# EAGLE schematic Precision Arduino 7400 (EAGLE 6.2)
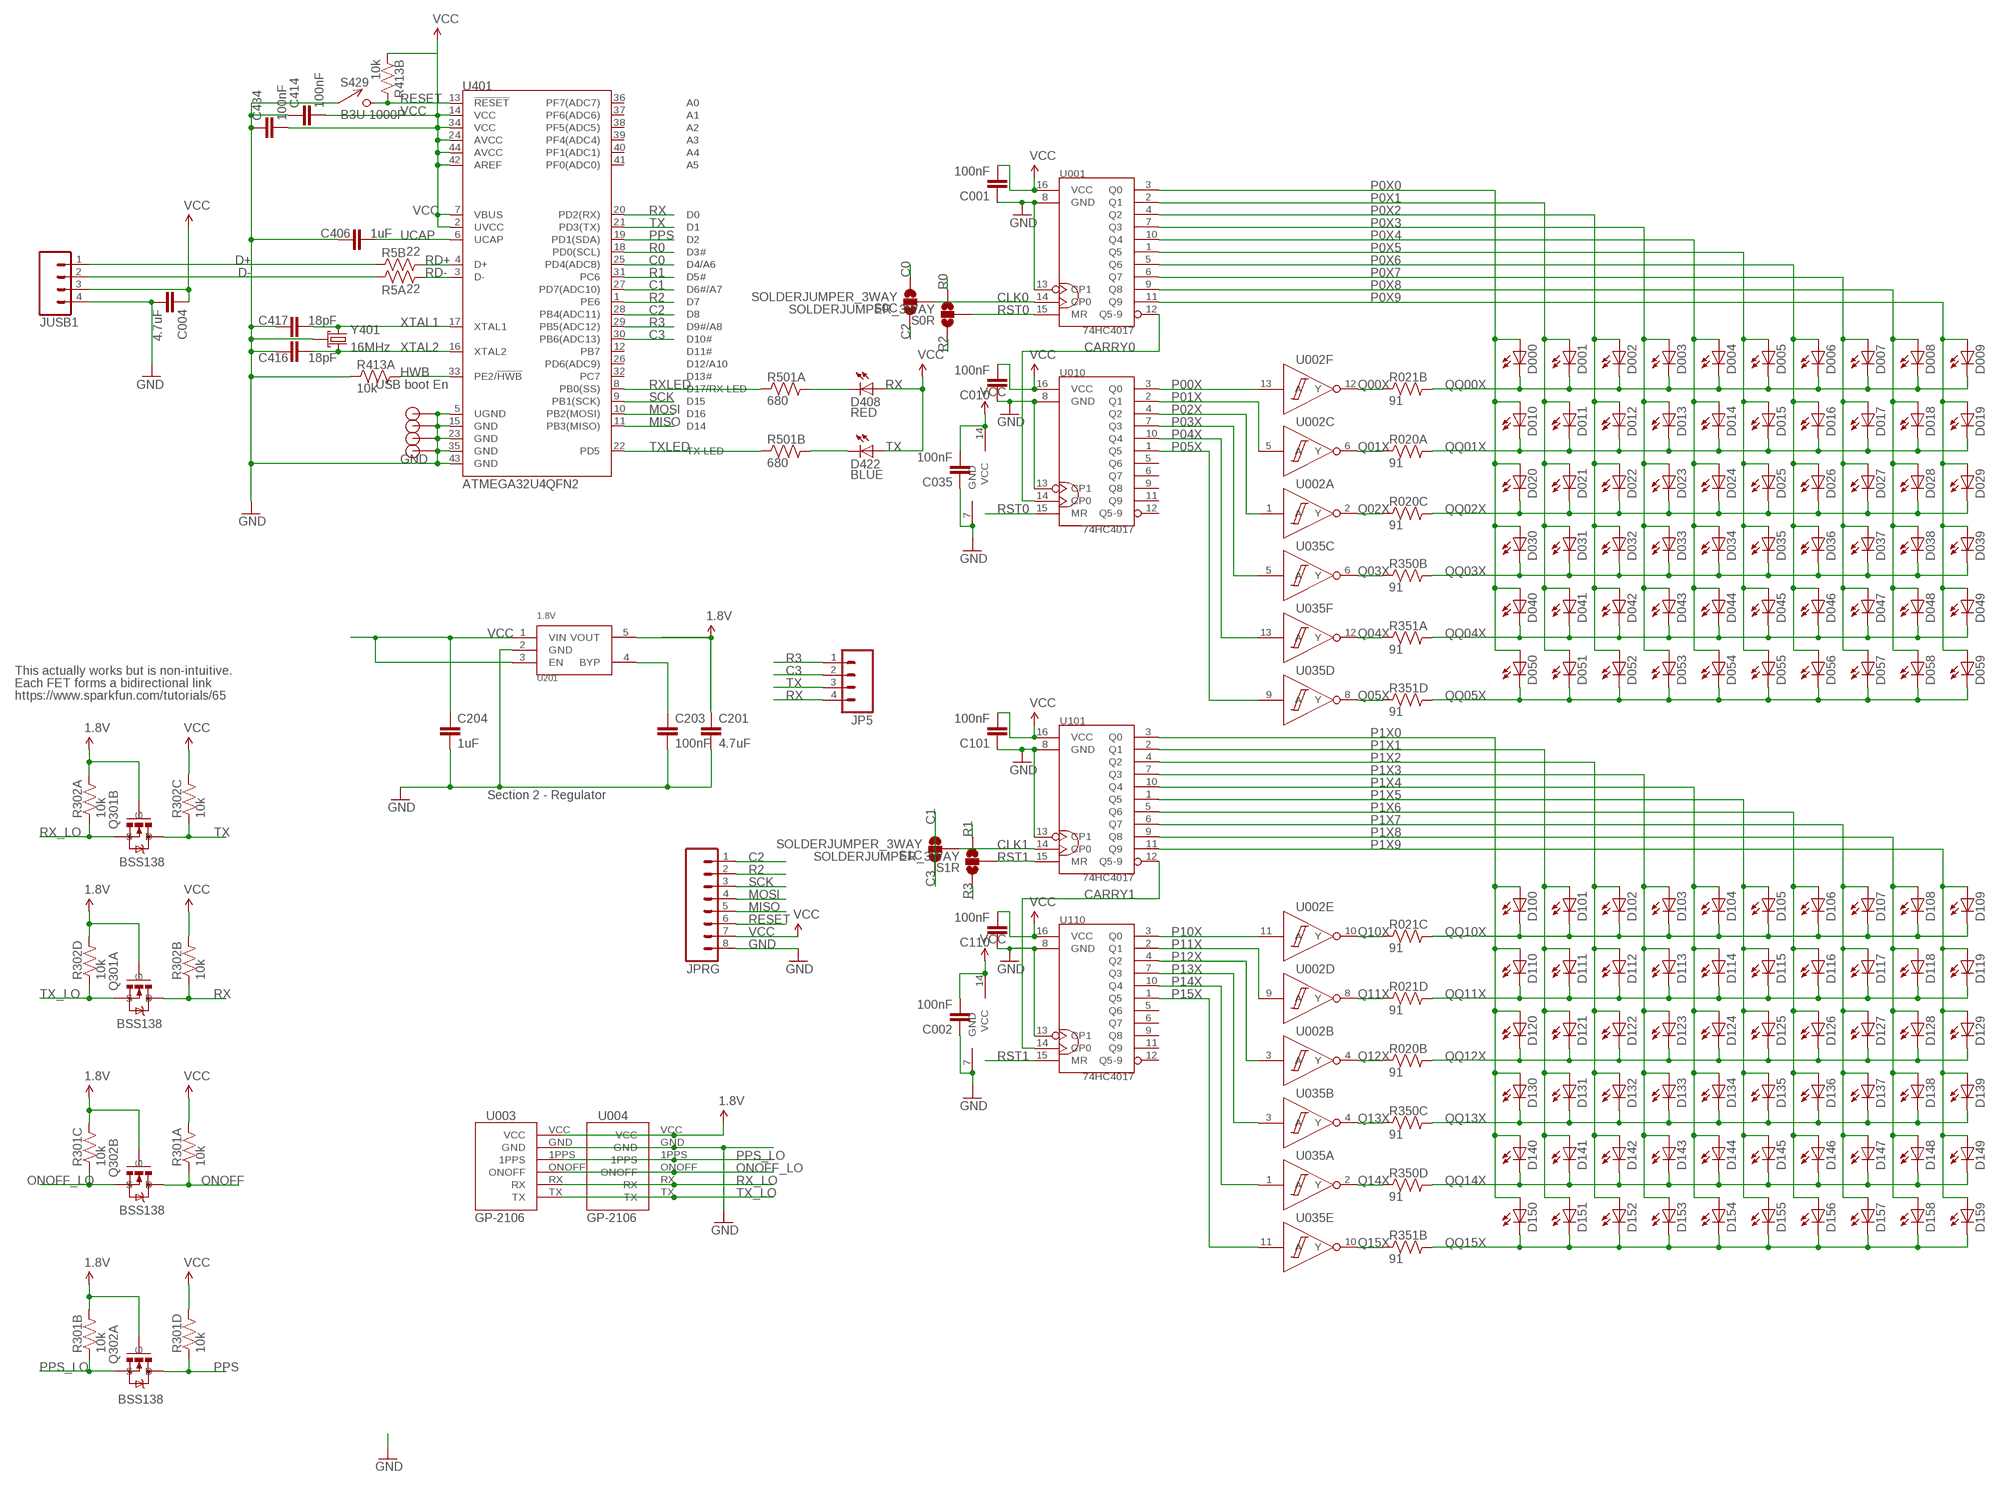
[diagram p0: schematic, sheet 1]

## Parts
C001  100nF  CAP0603-CAP  [0603-CAP]
C002  100nF  CAP0603-CAP  [0603-CAP]
C004  4.7uF  CAP0603-CAP  [0603-CAP]
C010  100nF  CAP0603-CAP  [0603-CAP]
C035  100nF  CAP0603-CAP  [0603-CAP]
C101  100nF  CAP0603-CAP  [0603-CAP]
C110  100nF  CAP0603-CAP  [0603-CAP]
C201  4.7uF  CAP0603-CAP  [0603-CAP]
C203  100nF  CAP0603-CAP  [0603-CAP]
C204  1uF  CAP0603-CAP  [0603-CAP]
C406  1uF  CAP0603-CAP  [0603-CAP]
C414  100nF  CAP0603-CAP  [0603-CAP]
C416  18pF  CAP0603-CAP  [0603-CAP]
C417  18pF  CAP0603-CAP  [0603-CAP]
C434  100nF  CAP0603-CAP  [0603-CAP]
D000  RED  LED0603  [LED-0603]
D001  RED  LED0603  [LED-0603]
D002  RED  LED0603  [LED-0603]
D003  RED  LED0603  [LED-0603]
D004  RED  LED0603  [LED-0603]
D005  RED  LED0603  [LED-0603]
D006  RED  LED0603  [LED-0603]
D007  RED  LED0603  [LED-0603]
D008  RED  LED0603  [LED-0603]
D009  RED  LED0603  [LED-0603]
D010  RED  LED0603  [LED-0603]
D011  RED  LED0603  [LED-0603]
D012  RED  LED0603  [LED-0603]
D013  RED  LED0603  [LED-0603]
D014  RED  LED0603  [LED-0603]
D015  RED  LED0603  [LED-0603]
D016  RED  LED0603  [LED-0603]
D017  RED  LED0603  [LED-0603]
D018  RED  LED0603  [LED-0603]
D019  RED  LED0603  [LED-0603]
D020  RED  LED0603  [LED-0603]
D021  RED  LED0603  [LED-0603]
D022  RED  LED0603  [LED-0603]
D023  RED  LED0603  [LED-0603]
D024  RED  LED0603  [LED-0603]
D025  RED  LED0603  [LED-0603]
D026  RED  LED0603  [LED-0603]
D027  RED  LED0603  [LED-0603]
D028  RED  LED0603  [LED-0603]
D029  RED  LED0603  [LED-0603]
D030  RED  LED0603  [LED-0603]
D031  RED  LED0603  [LED-0603]
D032  RED  LED0603  [LED-0603]
D033  RED  LED0603  [LED-0603]
D034  RED  LED0603  [LED-0603]
D035  RED  LED0603  [LED-0603]
D036  RED  LED0603  [LED-0603]
D037  RED  LED0603  [LED-0603]
D038  RED  LED0603  [LED-0603]
D039  RED  LED0603  [LED-0603]
D040  RED  LED0603  [LED-0603]
D041  RED  LED0603  [LED-0603]
D042  RED  LED0603  [LED-0603]
D043  RED  LED0603  [LED-0603]
D044  RED  LED0603  [LED-0603]
D045  RED  LED0603  [LED-0603]
D046  RED  LED0603  [LED-0603]
D047  RED  LED0603  [LED-0603]
D048  RED  LED0603  [LED-0603]
D049  RED  LED0603  [LED-0603]
D050  RED  LED0603  [LED-0603]
D051  RED  LED0603  [LED-0603]
D052  RED  LED0603  [LED-0603]
D053  RED  LED0603  [LED-0603]
D054  RED  LED0603  [LED-0603]
D055  RED  LED0603  [LED-0603]
D056  RED  LED0603  [LED-0603]
D057  RED  LED0603  [LED-0603]
D058  RED  LED0603  [LED-0603]
D059  RED  LED0603  [LED-0603]
D100  RED  LED0603  [LED-0603]
D101  RED  LED0603  [LED-0603]
D102  RED  LED0603  [LED-0603]
D103  RED  LED0603  [LED-0603]
D104  RED  LED0603  [LED-0603]
D105  RED  LED0603  [LED-0603]
D106  RED  LED0603  [LED-0603]
D107  RED  LED0603  [LED-0603]
D108  RED  LED0603  [LED-0603]
D109  RED  LED0603  [LED-0603]
D110  RED  LED0603  [LED-0603]
D111  RED  LED0603  [LED-0603]
D112  RED  LED0603  [LED-0603]
D113  RED  LED0603  [LED-0603]
D114  RED  LED0603  [LED-0603]
D115  RED  LED0603  [LED-0603]
D116  RED  LED0603  [LED-0603]
D117  RED  LED0603  [LED-0603]
D118  RED  LED0603  [LED-0603]
D119  RED  LED0603  [LED-0603]
D120  RED  LED0603  [LED-0603]
D121  RED  LED0603  [LED-0603]
D122  RED  LED0603  [LED-0603]
D123  RED  LED0603  [LED-0603]
D124  RED  LED0603  [LED-0603]
D125  RED  LED0603  [LED-0603]
D126  RED  LED0603  [LED-0603]
D127  RED  LED0603  [LED-0603]
D128  RED  LED0603  [LED-0603]
D129  RED  LED0603  [LED-0603]
D130  RED  LED0603  [LED-0603]
D131  RED  LED0603  [LED-0603]
D132  RED  LED0603  [LED-0603]
D133  RED  LED0603  [LED-0603]
D134  RED  LED0603  [LED-0603]
D135  RED  LED0603  [LED-0603]
D136  RED  LED0603  [LED-0603]
D137  RED  LED0603  [LED-0603]
D138  RED  LED0603  [LED-0603]
D139  RED  LED0603  [LED-0603]
D140  RED  LED0603  [LED-0603]
D141  RED  LED0603  [LED-0603]
D142  RED  LED0603  [LED-0603]
D143  RED  LED0603  [LED-0603]
D144  RED  LED0603  [LED-0603]
D145  RED  LED0603  [LED-0603]
D146  RED  LED0603  [LED-0603]
D147  RED  LED0603  [LED-0603]
D148  RED  LED0603  [LED-0603]
D149  RED  LED0603  [LED-0603]
D150  RED  LED0603  [LED-0603]
D151  RED  LED0603  [LED-0603]
D152  RED  LED0603  [LED-0603]
D153  RED  LED0603  [LED-0603]
D154  RED  LED0603  [LED-0603]
D155  RED  LED0603  [LED-0603]
D156  RED  LED0603  [LED-0603]
D157  RED  LED0603  [LED-0603]
D158  RED  LED0603  [LED-0603]
D159  RED  LED0603  [LED-0603]
D408  RED  LED0603  [LED-0603]
D422  BLUE  LED0603  [LED-0603]
JP1  STANDOFF  [STANDOFF]
JP2  STANDOFF  [STANDOFF]
JP3  STANDOFF  [STANDOFF]
JP4  STANDOFF  [STANDOFF]
JP5  M04PTH  [1X04]
JPRG  M081X08  [1X08]
JUSB1  M04PTH  [1X04]
Q301  BSS138DW  [SOT-363]
Q302  BSS138DW  [SOT-363]
R5  22  RP2EXB24V  [CRA02]
R020  91  RP404  [CRA04]
R021  91  RP404  [CRA04]
R301  10k  RP404  [CRA04]
R302  10k  RP404  [CRA04]
R350  91  RP404  [CRA04]
R351  91  RP404  [CRA04]
R413  10k  RP2EXB24V  [CRA02]
R501  680  RP2EXB24V  [CRA02]
S0C  SOLDERJUMPER_3WAY  [SJ_3]
S0R  SOLDERJUMPER_3WAY  [SJ_3]
S1C  SOLDERJUMPER_3WAY  [SJ_3]
S1R  SOLDERJUMPER_3WAY  [SJ_3]
S429  B3U-1000P  [B3U-1000P]
U001  74HC4017  [DHVQFN16]
U002  74LVC14A  [DHVQFN14]
U003  GP-2106  [GP-2106]
U004  GP-2106  [GP-2106]
U010  74HC4017  [DHVQFN16]
U035  74LVC14A  [DHVQFN14]
U101  74HC4017  [DHVQFN16]
U110  74HC4017  [DHVQFN16]
U201  1.8V  MIC5319D5  [SOT-23-5]
U401  ATMEGA32U4QFN2  [SPARKFUN-DIGITALIC_QFN-44-NOPAD]
Y401  16MHz  TSX-3225  [CRYSTAL_SMD]

## Nets
1.8V: C201.1 Q301.2(A:G) Q301.5(B:G) Q302.2(A:G) Q302.5(B:G) R301.6 R301.7 R302.5 R302.8 U003.VCC U004.VCC U201.5(VOUT)
C0: S0C.3 U401.25(PD4(ADC8))
C1: S1C.1 U401.27(PD7(ADC10))
C2: JPRG.1 S0C.1 U401.28(PB4(ADC11))
C3: JP5.2 S1C.3 U401.30(PB6(ADC13))
CARRY0: U001.12(Q5-9) U010.14(CP0)
CARRY1: U101.12(Q5-9) U110.14(CP0)
CLK0: S0C.COM U001.14(CP0)
CLK1: S1C.COM U101.14(CP0)
D+: JUSB1.1 R5.2
D-: JUSB1.2 R5.1
GND: C001.1 C002.1 C004.2 C010.1 C035.1 C101.1 C110.1 C201.2 C203.2 C204.2 C406.2 C414.1 C416.1 C417.1 C434.1 JP1.P$1 JP2.P$1 JP3.P$1 JP4.P$1 JPRG.8 JUSB1.4 R413.1 S429.P$1 U001.8(GND) U001.13(CP1) U002.7(GND) U003.GND U004.GND U010.8(GND) U010.13(CP1) U035.7(GND) U101.8(GND) U101.13(CP1) U110.8(GND) U110.13(CP1) U201.2(GND) U401.5(UGND) U401.15(GND) U401.23(GND) U401.35(GND) U401.43(GND) Y401.2(GND) Y401.4(GND)
HWB: R413.4 U401.33(PE2/!HWB)
MISO: JPRG.5 U401.11(PB3(MISO))
MOSI: JPRG.4 U401.10(PB2(MOSI))
N$17: C203.1 U201.4(BYP)
ONOFF: Q302.3(B:D) R301.1
ONOFF_LO: Q302.4(B:S) R301.3 U003.ONOFF U004.ONOFF
P00X: U002.13(F:A) U010.3(Q0)
P0X0: D000.A D010.A D020.A D030.A D040.A D050.A U001.3(Q0)
P0X1: D001.A D011.A D021.A D031.A D041.A D051.A U001.2(Q1)
P0X2: D002.A D012.A D022.A D032.A D042.A D052.A U001.4(Q2)
P0X3: D003.A D013.A D023.A D033.A D043.A D053.A U001.7(Q3)
P0X4: D004.A D014.A D024.A D034.A D044.A D054.A U001.10(Q4)
P0X5: D005.A D015.A D025.A D035.A D045.A D055.A U001.1(Q5)
P0X6: D006.A D016.A D026.A D036.A D046.A D056.A U001.5(Q6)
P0X7: D007.A D017.A D027.A D037.A D047.A D057.A U001.6(Q7)
P0X8: D008.A D018.A D028.A D038.A D048.A D058.A U001.9(Q8)
P0X9: D009.A D019.A D029.A D039.A D049.A D059.A U001.11(Q9)
P01X: U002.5(C:A) U010.2(Q1)
P1X0: D100.A D110.A D120.A D130.A D140.A D150.A U101.3(Q0)
P1X1: D101.A D111.A D121.A D131.A D141.A D151.A U101.2(Q1)
P1X2: D102.A D112.A D122.A D132.A D142.A D152.A U101.4(Q2)
P1X3: D103.A D113.A D123.A D133.A D143.A D153.A U101.7(Q3)
P1X4: D104.A D114.A D124.A D134.A D144.A D154.A U101.10(Q4)
P1X5: D105.A D115.A D125.A D135.A D145.A D155.A U101.1(Q5)
P1X6: D106.A D116.A D126.A D136.A D146.A D156.A U101.5(Q6)
P1X7: D107.A D117.A D127.A D137.A D147.A D157.A U101.6(Q7)
P1X8: D108.A D118.A D128.A D138.A D148.A D158.A U101.9(Q8)
P1X9: D109.A D119.A D129.A D139.A D149.A D159.A U101.11(Q9)
P02X: U002.1(A:A) U010.4(Q2)
P03X: U010.7(Q3) U035.5(C:A)
P04X: U010.10(Q4) U035.13(F:A)
P05X: U010.1(Q5) U035.9(D:A)
P10X: U002.11(E:A) U110.3(Q0)
P11X: U002.9(D:A) U110.2(Q1)
P12X: U002.3(B:A) U110.4(Q2)
P13X: U035.3(B:A) U110.7(Q3)
P14X: U035.1(A:A) U110.10(Q4)
P15X: U035.11(E:A) U110.1(Q5)
PPS: Q302.6(A:D) R301.4 U401.19(PD1(SDA))
PPS_LO: Q302.1(A:S) R301.2 U003.1PPS U004.1PPS
Q00X: R021.2 U002.12(F:Y)
Q01X: R020.1 U002.6(C:Y)
Q02X: R020.3 U002.2(A:Y)
Q03X: R350.2 U035.6(C:Y)
Q04X: R351.1 U035.12(F:Y)
Q05X: R351.4 U035.8(D:Y)
Q10X: R021.3 U002.10(E:Y)
Q11X: R021.4 U002.8(D:Y)
Q12X: R020.2 U002.4(B:Y)
Q13X: R350.3 U035.4(B:Y)
Q14X: R350.4 U035.2(A:Y)
Q15X: R351.2 U035.10(E:Y)
QQ00X: D000.C D001.C D002.C D003.C D004.C D005.C D006.C D007.C D008.C D009.C R021.7
QQ01X: D010.C D011.C D012.C D013.C D014.C D015.C D016.C D017.C D018.C D019.C R020.8
QQ02X: D020.C D021.C D022.C D023.C D024.C D025.C D026.C D027.C D028.C D029.C R020.6
QQ03X: D030.C D031.C D032.C D033.C D034.C D035.C D036.C D037.C D038.C D039.C R350.7
QQ04X: D040.C D041.C D042.C D043.C D044.C D045.C D046.C D047.C D048.C D049.C R351.8
QQ05X: D050.C D051.C D052.C D053.C D054.C D055.C D056.C D057.C D058.C D059.C R351.5
QQ10X: D100.C D101.C D102.C D103.C D104.C D105.C D106.C D107.C D108.C D109.C R021.6
QQ11X: D110.C D111.C D112.C D113.C D114.C D115.C D116.C D117.C D118.C D119.C R021.5
QQ12X: D120.C D121.C D122.C D123.C D124.C D125.C D126.C D127.C D128.C D129.C R020.7
QQ13X: D130.C D131.C D132.C D133.C D134.C D135.C D136.C D137.C D138.C D139.C R350.6
QQ14X: D140.C D141.C D142.C D143.C D144.C D145.C D146.C D147.C D148.C D149.C R350.5
QQ15X: D150.C D151.C D152.C D153.C D154.C D155.C D156.C D157.C D158.C D159.C R351.7
R0: S0R.3 U401.18(PD0(SCL))
R1: S1R.3 U401.31(PC6)
R2: JPRG.2 S0R.1 U401.1(PE6)
R3: JP5.1 S1R.1 U401.29(PB5(ADC12))
RD+: R5.3 U401.4(D+)
RD-: R5.4 U401.3(D-)
RESET: JPRG.6 R413.3 S429.P$2 U401.13(!RESET)
RST0: S0R.COM U001.15(MR) U010.15(MR)
RST1: S1R.COM U101.15(MR) U110.15(MR)
RX: JP5.4 Q301.6(A:D) R302.2 U401.20(PD2(RX))
RX_LO: Q301.4(B:S) R302.1 U003.RX U004.RX
RXLED: R501.1 U401.8(PB0(SS))
RXLED+: D408.C R501.4
SCK: JPRG.3 U401.9(PB1(SCK))
TX: JP5.3 Q301.3(B:D) R302.3 U401.21(PD3(TX))
TX_LO: Q301.1(A:S) R302.4 U003.TX U004.TX
TXLED: R501.2 U401.22(PD5)
TXLED+: D422.C R501.3
UCAP: C406.1 U401.6(UCAP)
VCC: C001.2 C002.2 C004.1 C010.2 C035.2 C101.2 C110.2 C204.1 C414.2 C434.2 D408.A D422.A JPRG.7 JUSB1.3 R301.5 R301.8 R302.6 R302.7 R413.2 U001.16(VCC) U002.14(VCC) U010.16(VCC) U035.14(VCC) U101.16(VCC) U110.16(VCC) U201.1(VIN) U201.3(EN) U401.2(UVCC) U401.7(VBUS) U401.14(VCC) U401.24(AVCC) U401.34(VCC) U401.42(AREF) U401.44(AVCC)
XTAL1: C417.2 U401.17(XTAL1) Y401.1
XTAL2: C416.2 U401.16(XTAL2) Y401.3
Unconnected: R020.4 R020.5 R021.1 R021.8 R350.1 R350.8 R351.3 R351.6 U010.5(Q6) U010.6(Q7) U010.9(Q8) U010.11(Q9) U010.12(Q5-9) U110.5(Q6) U110.6(Q7) U110.9(Q8) U110.11(Q9) U110.12(Q5-9) U401.12(PB7) U401.26(PD6(ADC9)) U401.32(PC7) U401.36(PF7(ADC7)) U401.37(PF6(ADC6)) U401.38(PF5(ADC5)) U401.39(PF4(ADC4)) U401.40(PF1(ADC1)) U401.41(PF0(ADC0))

## Notes on the sheet
- USB boot En | RX
- TX
- This actually works but is non-intuitive.
- Each FET forms a bidirectional link
- https://www.sparkfun.com/tutorials/65
- Section 2 - Regulator
- BSS138
- BSS138
- BSS138
- BSS138

## Library data of the parts
C001 C002 C010 C035 C101 C110 C201 C203 C204 C414 C434 = SparkFun-Passives:CAP: Capacitor Standard 0603 ceramic capacitor, and 0.1" leaded capacitor.
C004 C406 C416 C417 = SparkFun:CAP: Capacitor Standard 0603 ceramic capacitor, and 0.1" leaded capacitor.
D000 D001-D009 D010-D059 D100-D159 = SparkFun-LED:LED: LEDs Standard schematic elements and footprints for 5mm, 3mm, 1206, and 0603 sized LEDs. 5mm - Spark Fun Electronics SKU : COM-00529 (and others)
D408 D422 = SparkFun:LED: LEDs Standard schematic elements and footprints for 5mm, 3mm, 1206, and 0603 sized LEDs. 5mm - Spark Fun Electronics SKU : COM-00529 (and others)
JP1-JP4 = KwanSystems:STANDOFF
JP5 = SparkFun-Connectors:M04: Header 4 Standard 4-pin 0.1" header. Use with straight break away headers (SKU : PRT-00116), right angle break away headers (PRT-00553), swiss pins (PRT-00743), machine pins (PRT-00117), and female headers (PRT-00115). Molex polarized connector foot print use with SKU : PRT-08231 with associated crimp pins and housings. 1MM SMD Version SKU: PRT-10208
JPRG = SparkFun-Connectors:M08: Header 8 Standard 8-pin 0.1" header. Use with straight break away headers (SKU : PRT-00116), right angle break away headers (PRT-00553), swiss pins (PRT-00743), machine pins (PRT-00117), and female headers (PRT-00115).
JUSB1 = SparkFun:M04: Header 4 Standard 4-pin 0.1" header. Use with straight break away headers (SKU : PRT-00116), right angle break away headers (PRT-00553), swiss pins (PRT-00743), machine pins (PRT-00117), and female headers (PRT-00115). Molex polarized connector foot print use with SKU : PRT-08231 with associated crimp pins and housings. 1MM SMD Version SKU: PRT-10208
Q301 Q302 = KwanSystems:BSS138DW: Transistor for bi-directional level-shifting See here <http://ics.nxp.com/support/documents/interface/pdf/an97055.pdf> for details . Two transistors in this package, can be used for two bidirectional channels.
R5 R413 R501 = KwanSystems:RP2
R020 R021 R301 R302 R350 R351 = KwanSystems:RP4
S0C S0R S1C S1R = KwanSystems:SOLDERJUMPER_3WAY
S429 = KwanSystems:B3U-1000P
U001 U010 U101 U110 = KwanSystems:74HC4017
U002 U035 = KwanSystems:74LVC14A
U003 U004 = SparkFun:GP-2106: GP-2106 GPS SiRF IV
U201 = KwanSystems:MIC5319
U401 = SparkFun-DigitalIC:ATMEGA32U4: Atmel 44-pin 8-bit Microcontroller with 32KBytes of ISP Flash and USB Controller
Y401 = KwanSystems:TSX-3225

## Net classes
0 default: width 0.152 mm, drill 0.33 mm, clearance 0.152 mm
1 power: width 0.152 mm, drill 0.33 mm, clearance 0.152 mm